# Altium schematic sheet X-01 NOTE.SchDoc
size 513 x 386 mm
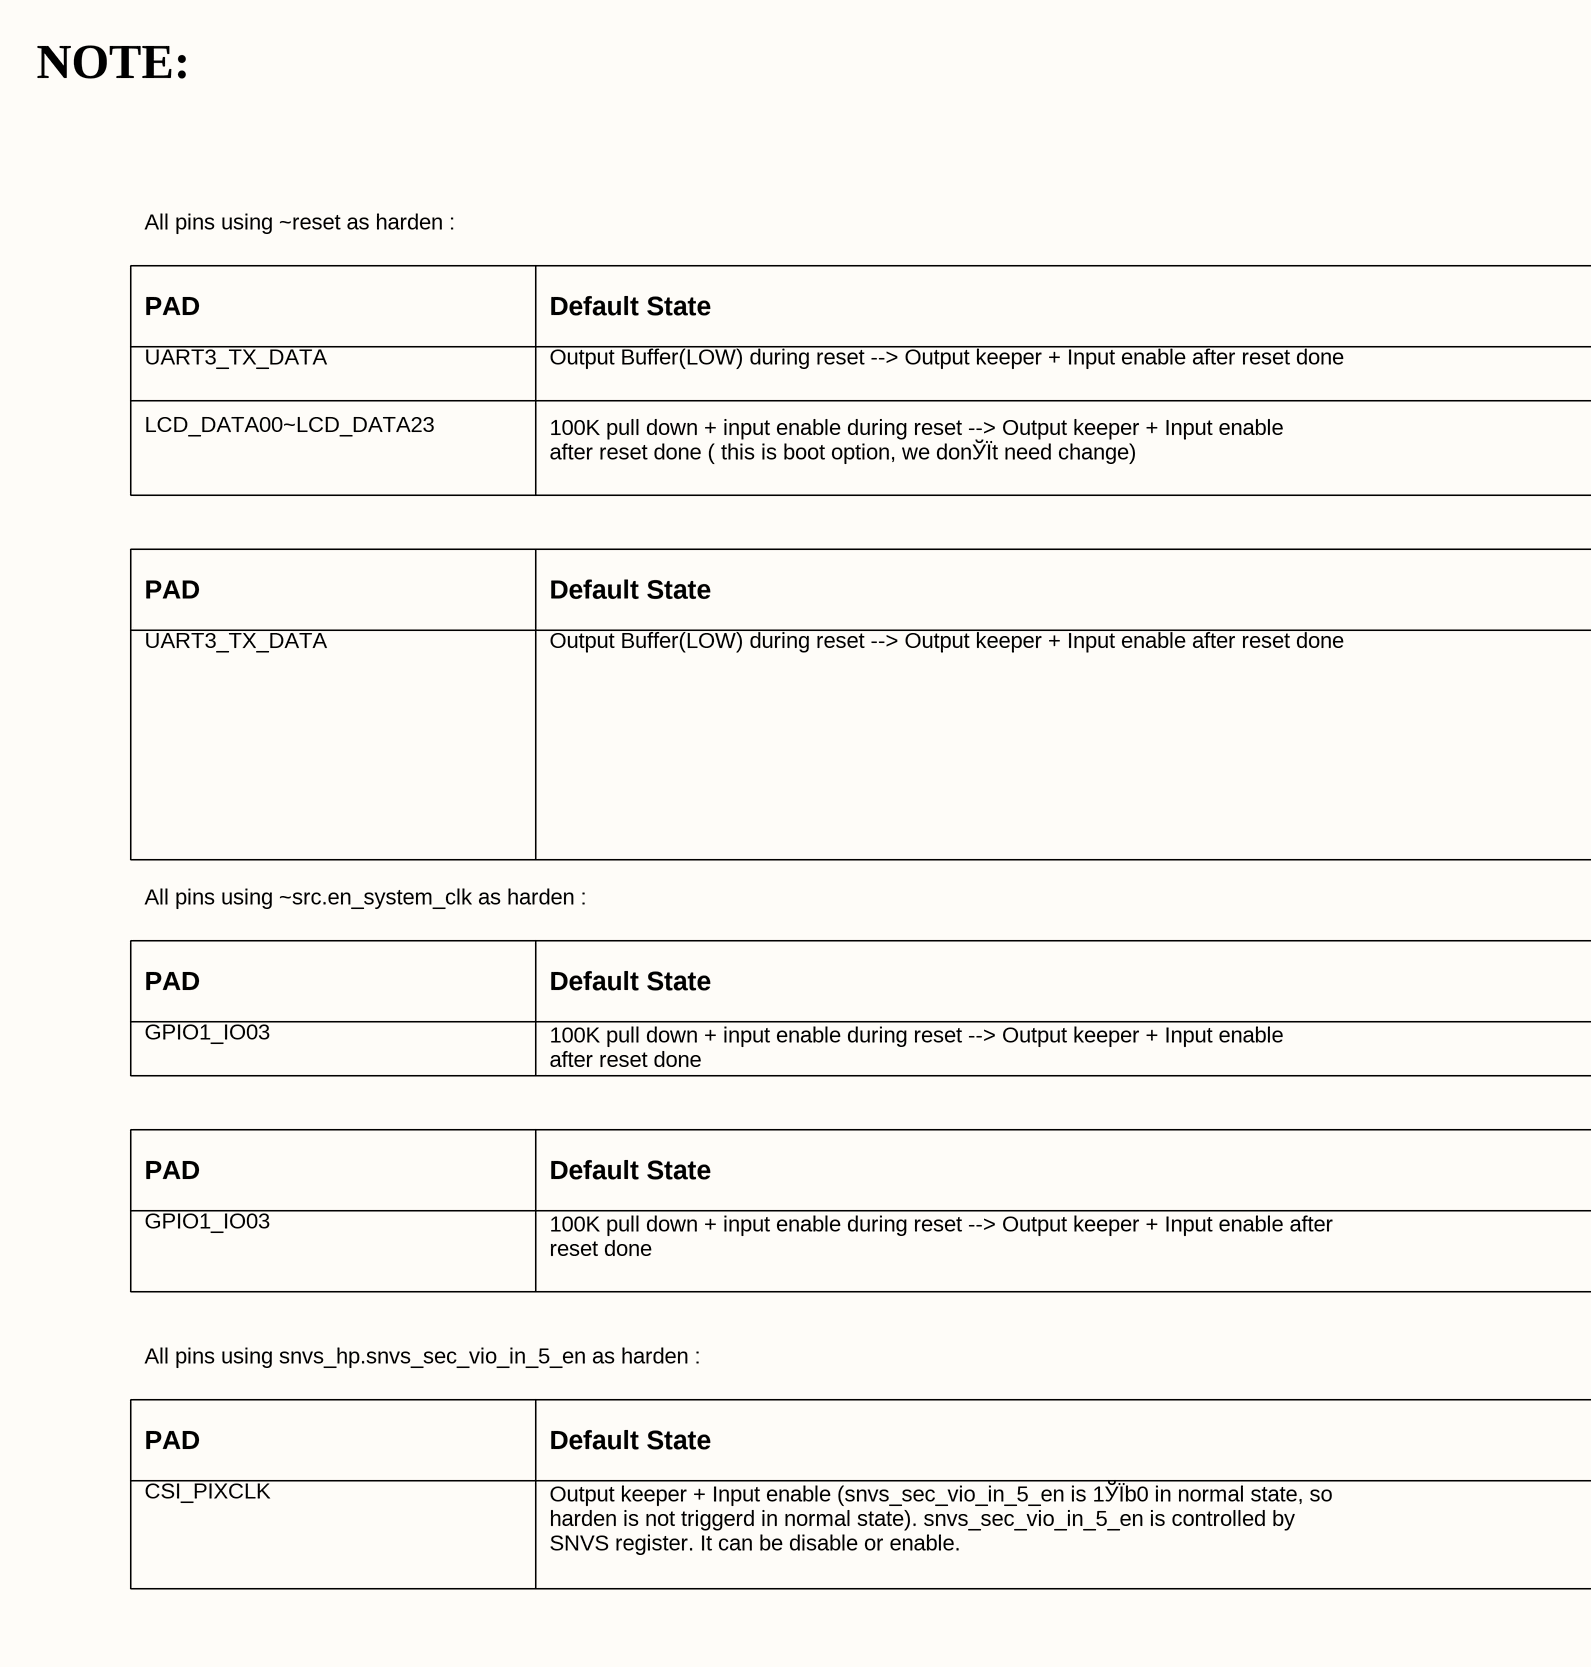
[diagram p0: X-01 NOTE.SchDoc, left]
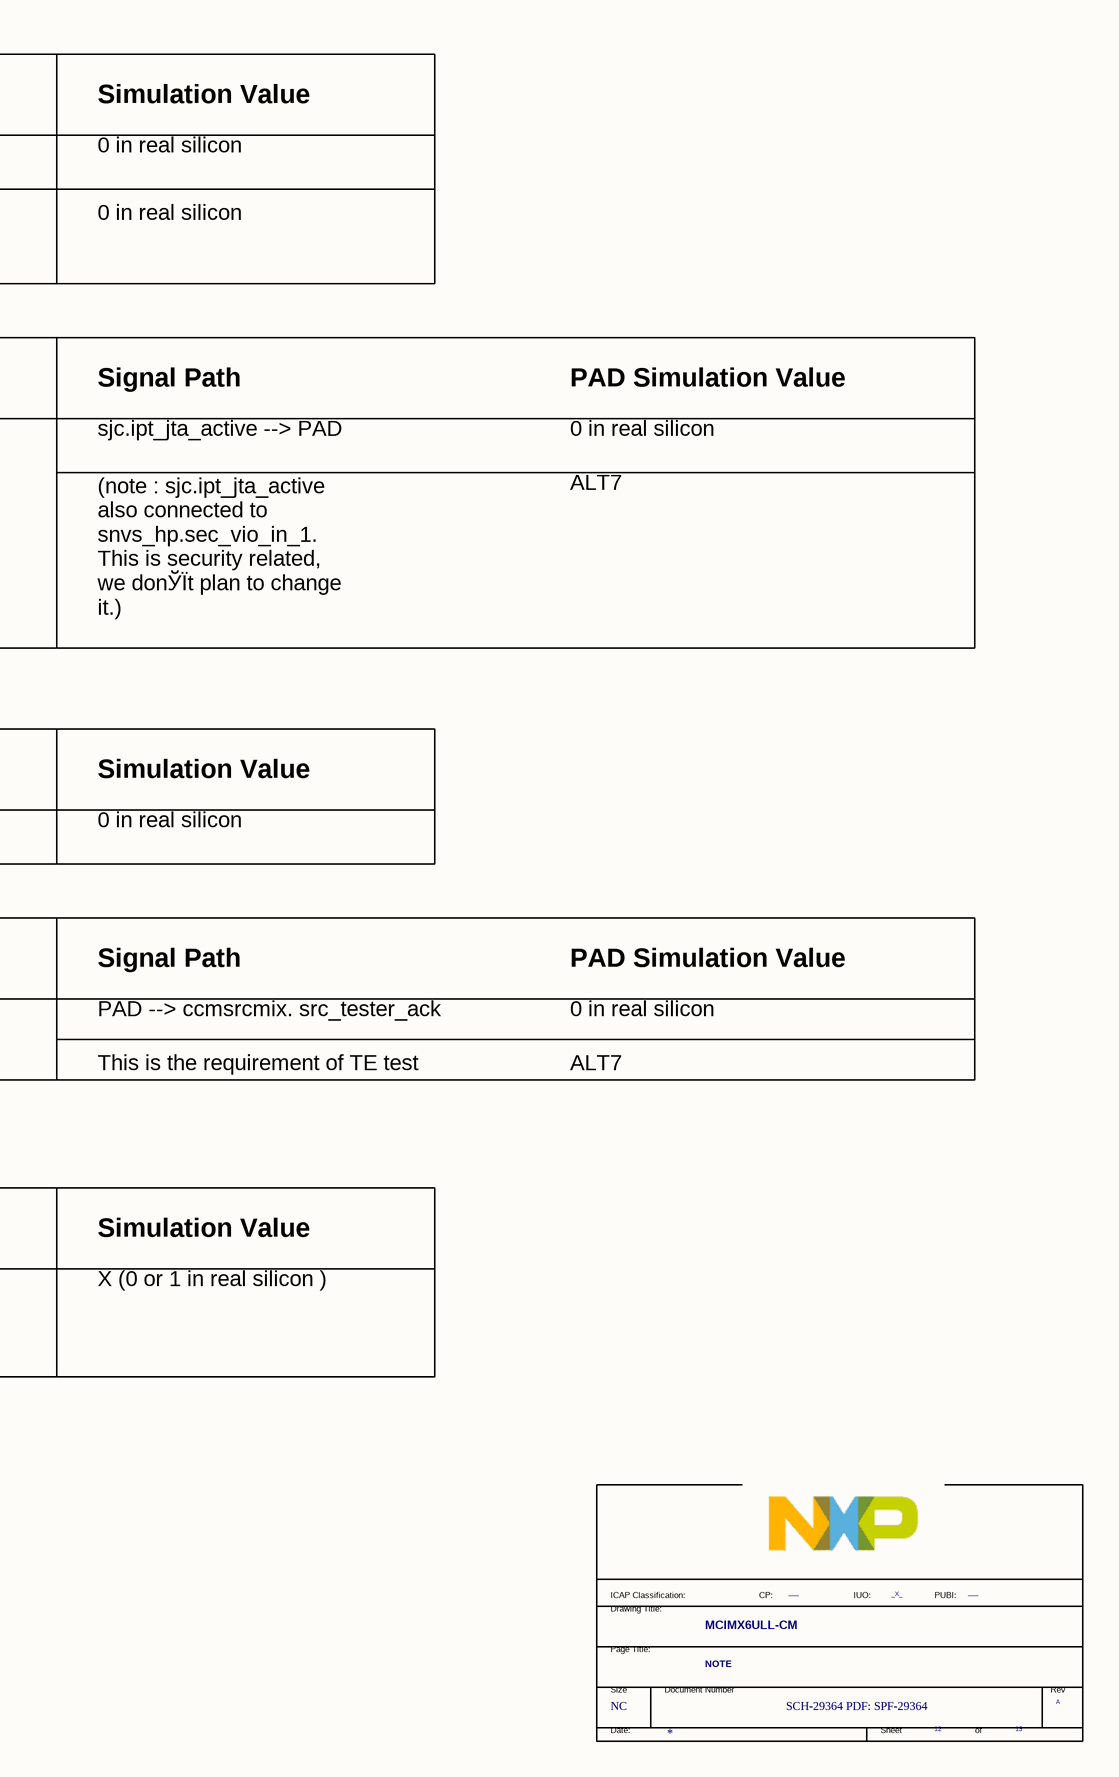
[diagram p1: X-01 NOTE.SchDoc, right]

## Parts
*  FIUO: _X_  PUBI: ___  Doc: SCH-29364 PDF: SPF-29364  RevCode: A  Title: MCIMX6ULL-CM  Page Size: NC  Page Number: 12  Page Count: 13  PageTitle: NOTE  (hidden comment: TitleBlock_FS)  (graphical)

## Notes on the sheet
- NOTE:
- All pins using ~reset as harden :
- PAD
- UART3_TX_DATA
- Output Buffer(LOW) during reset --> Output keeper + Input enable after reset done
- Default State
- 0 in real silicon
- Simulation Value
- LCD_DATA00~LCD_DATA23
- 100K pull down + input enable during reset --> Output keeper + Input enable
  after reset done ( this is boot option, we donЎЇt need change)
- Signal Path
- PAD Simulation Value
- sjc.ipt_jta_active --> PAD
- (note : sjc.ipt_jta_active
  also connected to
  snvs_hp.sec_vio_in_1.
  This is security related,
  we donЎЇt plan to change
  it.)
- ALT7
- All pins using ~src.en_system_clk as harden :
- GPIO1_IO03
- 100K pull down + input enable during reset --> Output keeper + Input enable
  after reset done
- 100K pull down + input enable during reset --> Output keeper + Input enable after
  reset done
- PAD --> ccmsrcmix. src_tester_ack
- This is the requirement of TE test
- All pins using snvs_hp.snvs_sec_vio_in_5_en as harden :
- CSI_PIXCLK
- Output keeper + Input enable (snvs_sec_vio_in_5_en is 1ЎЇb0 in normal state, so
  harden is not triggerd in normal state). snvs_sec_vio_in_5_en is controlled by
  SNVS register. It can be disable or enable.
- X (0 or 1 in real silicon )
- (in symbol TitleBlock_FS) ICAP Classification:; CP:; IUO:; PUBI:; Drawing Title:; Page Title:; Size; Document Number; Rev; Date:; Sheet; of

## Library data of the parts
* = TitleBlock_FS: OrgName: Freescale Semiconductor; OrgAddr1: 6501 William Cannon Drive West; OrgAddr2: Austin, TX 78735-8598; FCP: ___; Page Create Date: March  8, 1995; Page Modify Date: *